# Altium schematic sheet Main_Board.SchDoc
size A
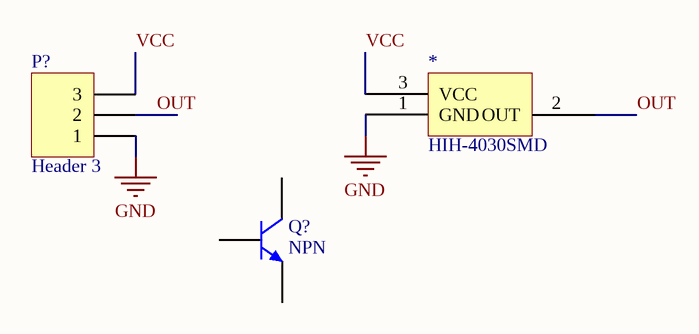
[diagram p0: Main_Board.SchDoc]

## Parts
*  HIH-4030SMD  [HIH-4030SMD]
P?  Header 3  [HDR1X3]
Q?  NPN  [TO-226-AA]

## Nets
GND: *.1(GND) P?.1
OUT: *.2(OUT) P?.2
VCC: *.3(VCC) P?.3

Not connected (* = marked no-connect by the designer): Q? 1(C) 2(B) 3(E)

## Library data of the parts
* = HIH-4030SMD: pin to pad: 1>3 3>1
P? = Header 3: Header, 3-Pin; LatestRevisionDate: 17-Jul-2002; LatestRevisionNote: Re-released for DXP Platform.; Publisher: Altium Limited
Q? = NPN: NPN Bipolar Transistor; Published: 8-Jun-2000; LatestRevisionDate: 17-Jul-2002; LatestRevisionNote: Re-released for DXP Platform.; PackageReference: TO-226-AA; Publisher: Altium Limited; PackageDescription: TO, Flat Index; 3 In-Line, Axial Leads; Body Dia. 4.8mm; Leads 0.55 x 0.51 mm (max); Code_JEDEC: TO-226-AA